# EAGLE design adapter_ADK_smt (EAGLE 6.1)
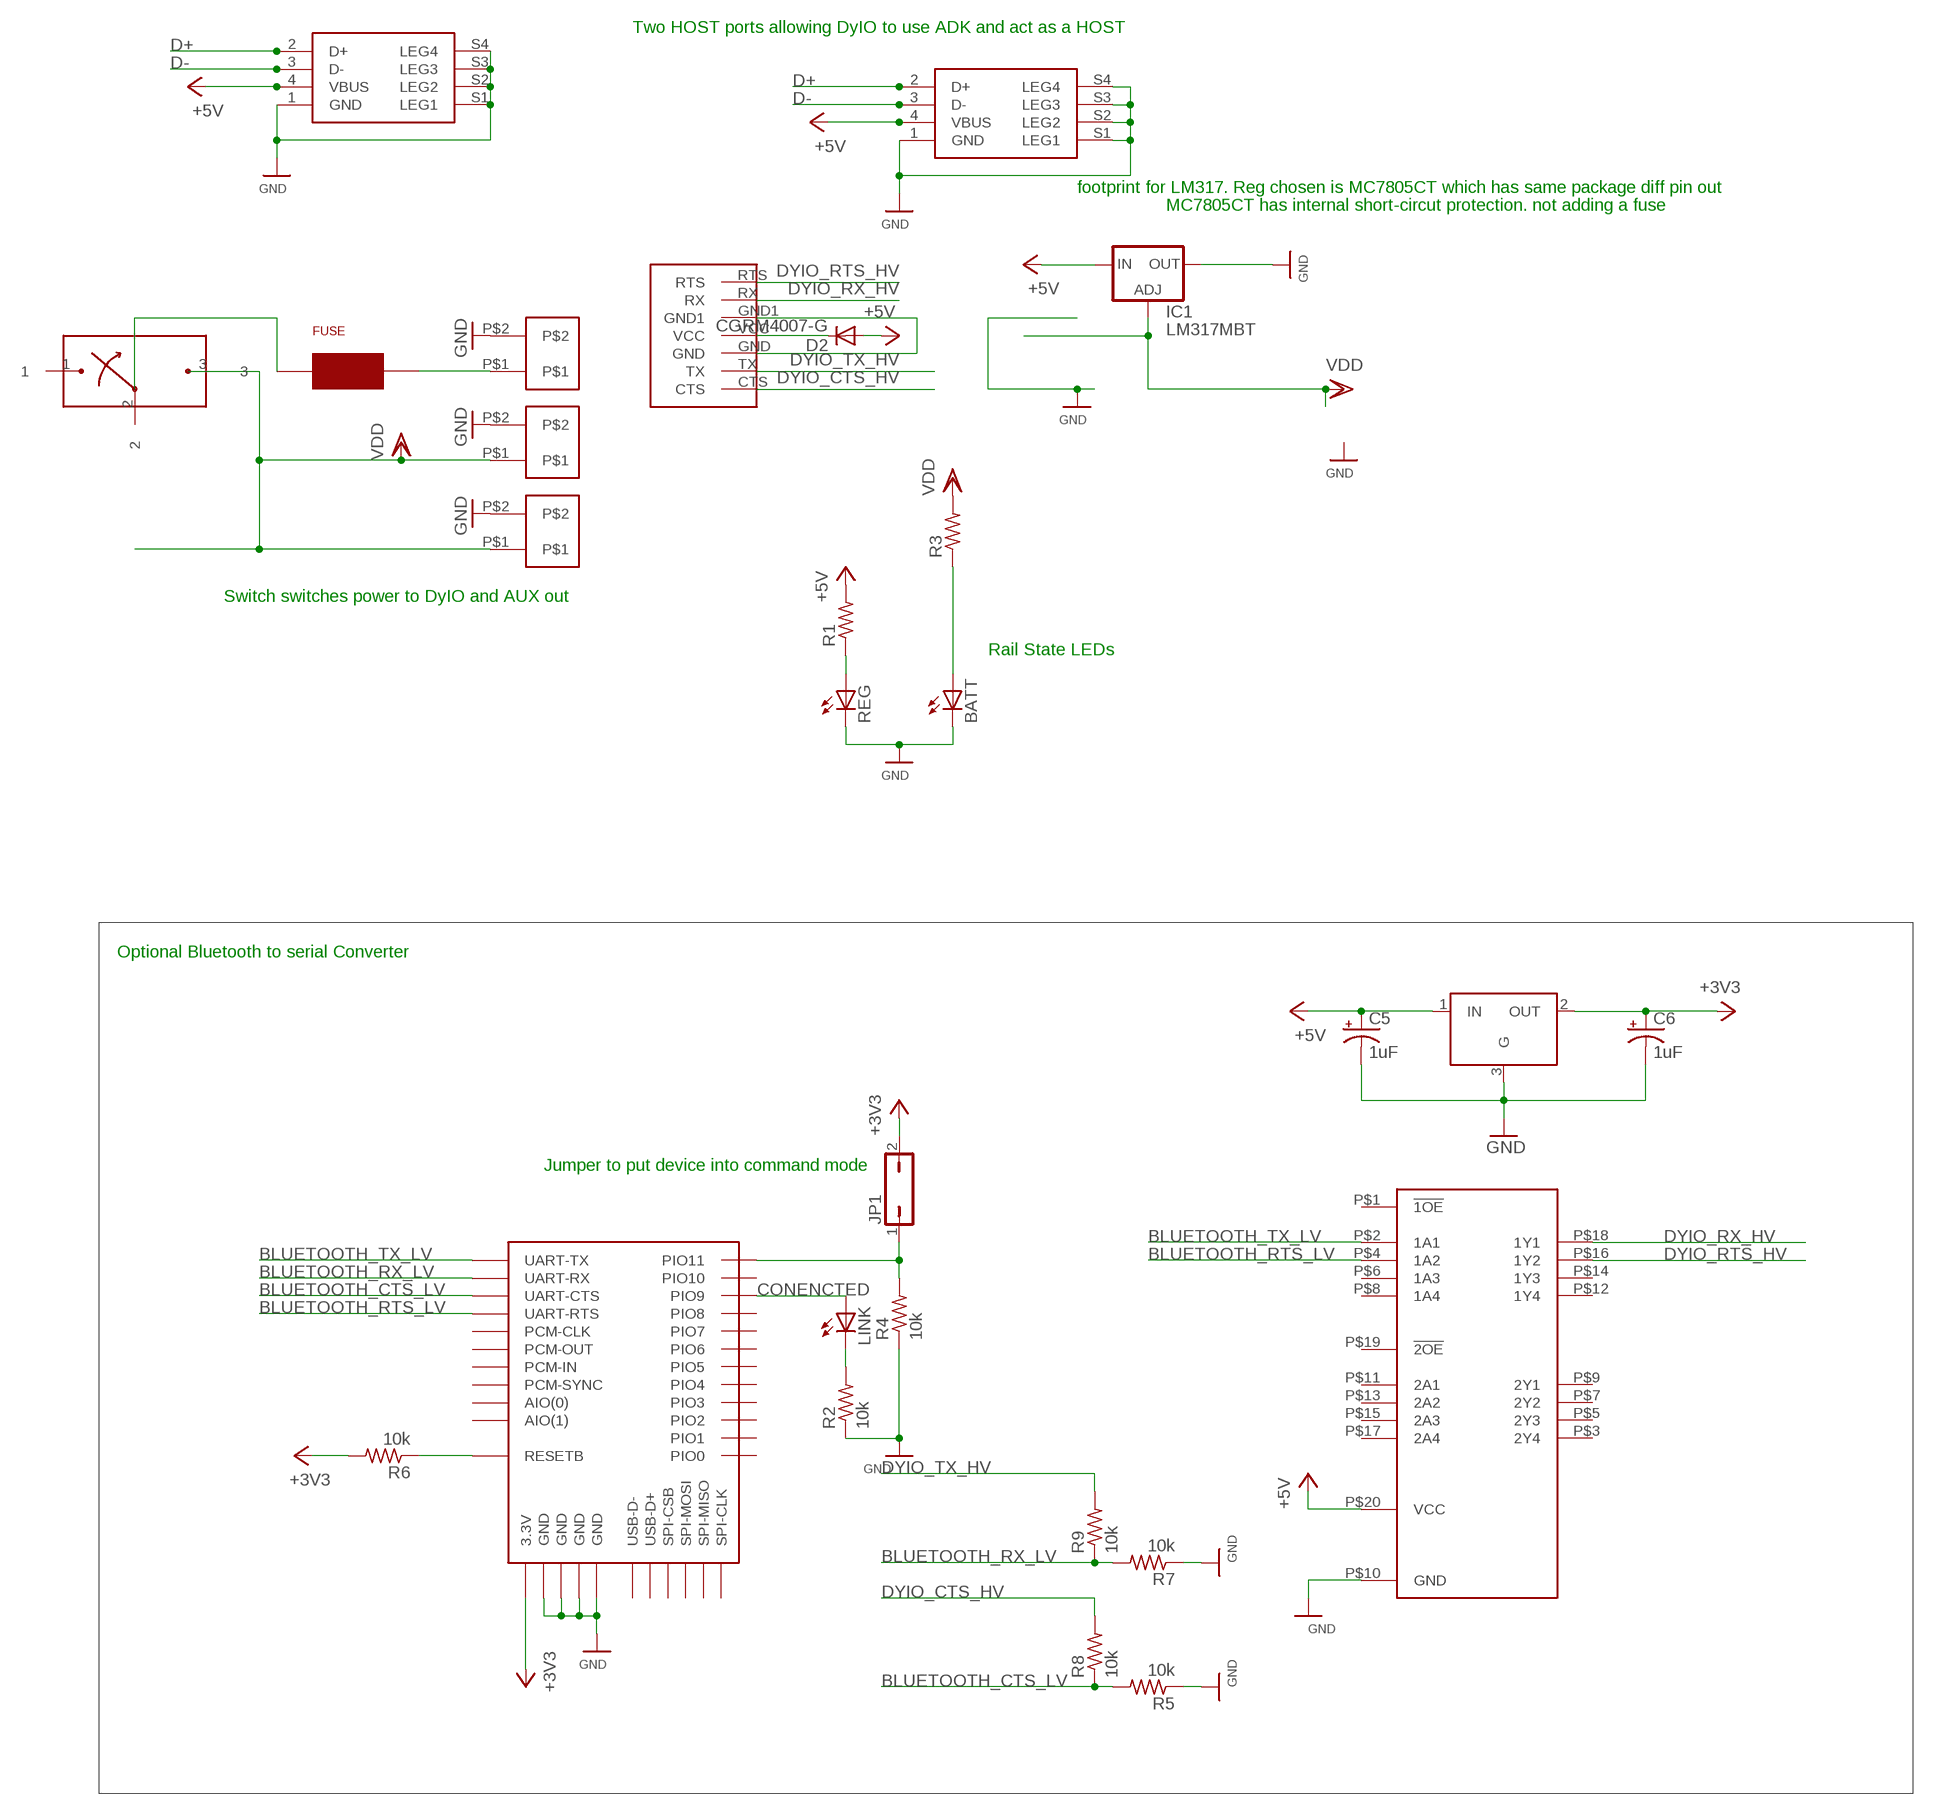
[diagram p0: schematic, sheet 1]

## Parts
BATT  LEDCHIPLED_0805  [CHIPLED_0805]
C5  1uF  CPOL-USR/2012-12R  [R/2012-12R]
C6  1uF  CPOL-USR/2012-12R  [R/2012-12R]
D2  CGRM4007-G  [SOD-123_MINI-SMA]
FUSE  0154  [0154]
IC1  LM317MBT  [TO220L1]
JP1  JP1Q  [JP1]
LINK  LEDCHIPLED_0805  [CHIPLED_0805]
R1  R-US_R0603  [R0603]
R2  10k  R-US_R0603  [R0603]
R3  R-US_R0603  [R0603]
R4  10k  R-US_R0603  [R0603]
R5  10k  R-US_R0603  [R0603]
R6  10k  R-US_R0603  [R0603]
R7  10k  R-US_R0603  [R0603]
R8  10k  R-US_R0603  [R0603]
R9  10k  R-US_R0603  [R0603]
REG  LEDCHIPLED_0805  [CHIPLED_0805]
U$1  SPDT  [L102021ML04Q]
U$3  2P  [2PTH]
U$4  2P  [2PTH]
U$6  BTM400_6B  [BTM400_6B]
U$7  SN74ACT24  [R-PDS0-G20]
U$8  USB  [USB-A1SXX]
U$9  USB  [USB-A1SXX]
U$10  WASP7PIN  [WASP7PIN]
U$11  AP7313  [SOT23-R]
U$19  2P  [2PTH]

## Nets
+3V3: C6.+ JP1.2 R6.2 U$6.3.3V U$11.2(OUT)
+5V: C5.+ D2.A IC1.3(IN) R1.2 U$7.P$20(VCC) U$8.4(VBUS) U$9.4(VBUS) U$11.1(IN)
BLUETOOTH_CTS_LV: R5.2 R8.1 U$6.UART-CTS
BLUETOOTH_RTS_LV: U$6.UART-RTS U$7.P$4(1A2)
BLUETOOTH_RX_LV: R7.2 R9.1 U$6.UART-RX
BLUETOOTH_TX_LV: U$6.UART-TX U$7.P$2(1A1)
CFG: JP1.1 R4.2 U$6.PIO(11)(PIO11)
CONENCTED: LINK.A U$6.PIO(9)(PIO9)
D+: U$8.2(D+) U$9.2(D+)
D-: U$8.3(D-) U$9.3(D-)
DYIO_CTS_HV: R8.2 U$10.CTS
DYIO_RTS_HV: U$7.P$16(1Y2) U$10.RTS
DYIO_RX_HV: U$7.P$18(1Y1) U$10.RX
DYIO_TX_HV: R9.2 U$10.TX
GND: BATT.C C5.- C6.- IC1.2(OUT) R2.1 R4.1 R5.1 R7.1 REG.C U$3.P$2 U$4.P$2 U$6.GND@1(GND) U$6.GND@2(GND) U$6.GND@3(GND) U$6.GND@4(GND) U$7.P$10(GND) U$8.1(GND) U$8.S1(LEG1) U$8.S2(LEG2) U$8.S3(LEG3) U$8.S4(LEG4) U$9.1(GND) U$9.S1(LEG1) U$9.S2(LEG2) U$9.S3(LEG3) U$9.S4(LEG4) U$10.GND U$10.GND1 U$11.3(G) U$19.P$2
N$1: FUSE.1 U$1.2
N$2: FUSE.2 U$3.P$1
N$3: R1.1 REG.A
N$4: LINK.C R2.2
N$6: BATT.A R3.1
N$7: D2.C U$10.VCC
N$8: R6.1 U$6.RESETB
VDD: IC1.1(ADJ) R3.2 U$1.3 U$4.P$1 U$19.P$1
Unconnected: U$1.1 U$6.AIO(0) U$6.AIO(1) U$6.PCM-CLK U$6.PCM-IN U$6.PCM-OUT U$6.PCM-SYNC U$6.PIO(0)(PIO0) U$6.PIO(1)(PIO1) U$6.PIO(2)(PIO2) U$6.PIO(3)(PIO3) U$6.PIO(4)(PIO4) U$6.PIO(5)(PIO5) U$6.PIO(6)(PIO6) U$6.PIO(7)(PIO7) U$6.PIO(8)(PIO8) U$6.PIO(10)(PIO10) U$6.SPI-CLK U$6.SPI-CSB U$6.SPI-MISO U$6.SPI-MOSI U$6.USB-D+ U$6.USB-D- U$7.P$1(!1OE) U$7.P$3(2Y4) U$7.P$5(2Y3) U$7.P$6(1A3) U$7.P$7(2Y2) U$7.P$8(1A4) U$7.P$9(2Y1) U$7.P$11(2A1) U$7.P$12(1Y4) U$7.P$13(2A2) U$7.P$14(1Y3) U$7.P$15(2A3) U$7.P$17(2A4) U$7.P$19(!2OE)

## Notes on the sheet
- Two HOST ports allowing DyIO to use ADK and act as a HOST
- footprint for LM317. Reg chosen is MC7805CT which has same package diff pin out
- MC7805CT has internal short-circut protection. not adding a fuse
- Switch switches power to DyIO and AUX out
- Rail State LEDs
- Optional Bluetooth to serial Converter
- Jumper to put device into command mode

## Library data of the parts
BATT LINK REG = led:LED: LED OSRAM: - CHIPLED LG R971, LG N971, LY N971, LG Q971, LY Q971, LO R971, LY R971 LH N974, LH R974 LS Q976, LO Q976, LY Q976 LO Q996 - Hyper CHIPLED LW Q18S LB Q993, LB Q99A, LB R99A - SideLED LS A670, LO A670, LY A670, LG A670, LP A670 LB A673, LV A673, LT A673, LW A673 LH A674 LY A675 LS A676, LA A676, LO A676, LY A676, LW A676 LS A679, LY A679, LG A679 - Hyper Micro SIDELED® LS Y876, LA Y876, LO Y876, LY Y876 LT Y87S - SmartLED LW L88C, LW L88S LB L89C, LB L89S, LG L890 LS L89K, LO L89K, LY L89K LS L896, LA L896, LO L896, LY L896 - TOPLED LS T670, LO T670, LY T670, LG T670, LP T670 LSG T670, LSP T670, LSY T670, LOP T670, LYG T670 LG T671, LOG T671, LSG T671 LB T673, LV T673, LT T673, LW T673 LH T674 LS T676, LA T676, LO T676, LY T676, LB T676, LH T676, LSB T676, LW T676 LB T67C, LV T67C, LT T67C, LS T67K, LO T67K, LY T67K, LW E67C LS E67B, LA E67B, LO E67B, LY E67B, LB E67C, LV E67C, LT E67C LW T67C LS T679, LY T679, LG T679 LS T770, LO T770, LY T770, LG T770, LP T770 LB T773, LV T773, LT T773, LW T773 LH T774 LS E675, LA E675, LY E675, LS T675 LS T776, LA T776, LO T776, LY T776, LB T776 LHGB T686 LT T68C, LB T68C - Hyper Mini TOPLED® LB M676 - Mini TOPLED Santana® LG M470 LS M47K, LO M47K, LY M47K Source: http://www.osram.convergy.de LUXEON: - LUMILED® LXK2-PW12-R00, LXK2-PW12-S00, LXK2-PW14-U00, LXK2-PW14-V00 LXK2-PM12-R00, LXK2-PM12-S00, LXK2-PM14-U00 LXK2-PE12-Q00, LXK2-PE12-R00, LXK2-PE12-S00, LXK2-PE14-T00, LXK2-PE14-U00 LXK2-PB12-K00, LXK2-PB12-L00, LXK2-PB12-M00, LXK2-PB14-N00, LXK2-PB14-P00, LXK2-PB14-Q00 LXK2-PR12-L00, LXK2-PR12-M00, LXK2-PR14-Q00, LXK2-PR14-R00 LXK2-PD12-Q00, LXK2-PD12-R00, LXK2-PD12-S00 LXK2-PH12-R00, LXK2-PH12-S00 LXK2-PL12-P00, LXK2-PL12-Q00, LXK2-PL12-R00 Source: www.luxeon.com KINGBRIGHT: KA-3528ASYC Source: www.kingbright.com
C5 C6 = rcl:CPOL-US: POLARIZED CAPACITOR, American symbol
D2 = diode:CGRM400*-G: Molded plasitc,JEDEC SOD-123/Mini SMA Source: Comchip CGRM4001-G.pdf
FUSE = SMT_Fuse_0154001:0154
IC1 = v-reg:LM317?*: 500 mA Adjustable Output Positive Voltage Regulator Source: http://www.onsemi.co.jp .. LM317M-D.PDF
JP1 = jumper:JP1Q: JUMPER
R1 R3 = rcl:R-US_: RESISTOR, American symbol
R2 R4-R9 = resistor:R-US_: RESISTOR, American symbol
U$1 = L102021ML04Q:SPDT
U$3 U$4 U$19 = con_2h_70555-0001:2P
U$6 = misc:BTM400_6B
U$7 = sn74act24:SN74ACT24
U$8 U$9 = usb-a1ss_vert_usb_a:USB
U$10 = wasp7pin:WASP7PIN
U$11 = ap7313:AP7313

## Board
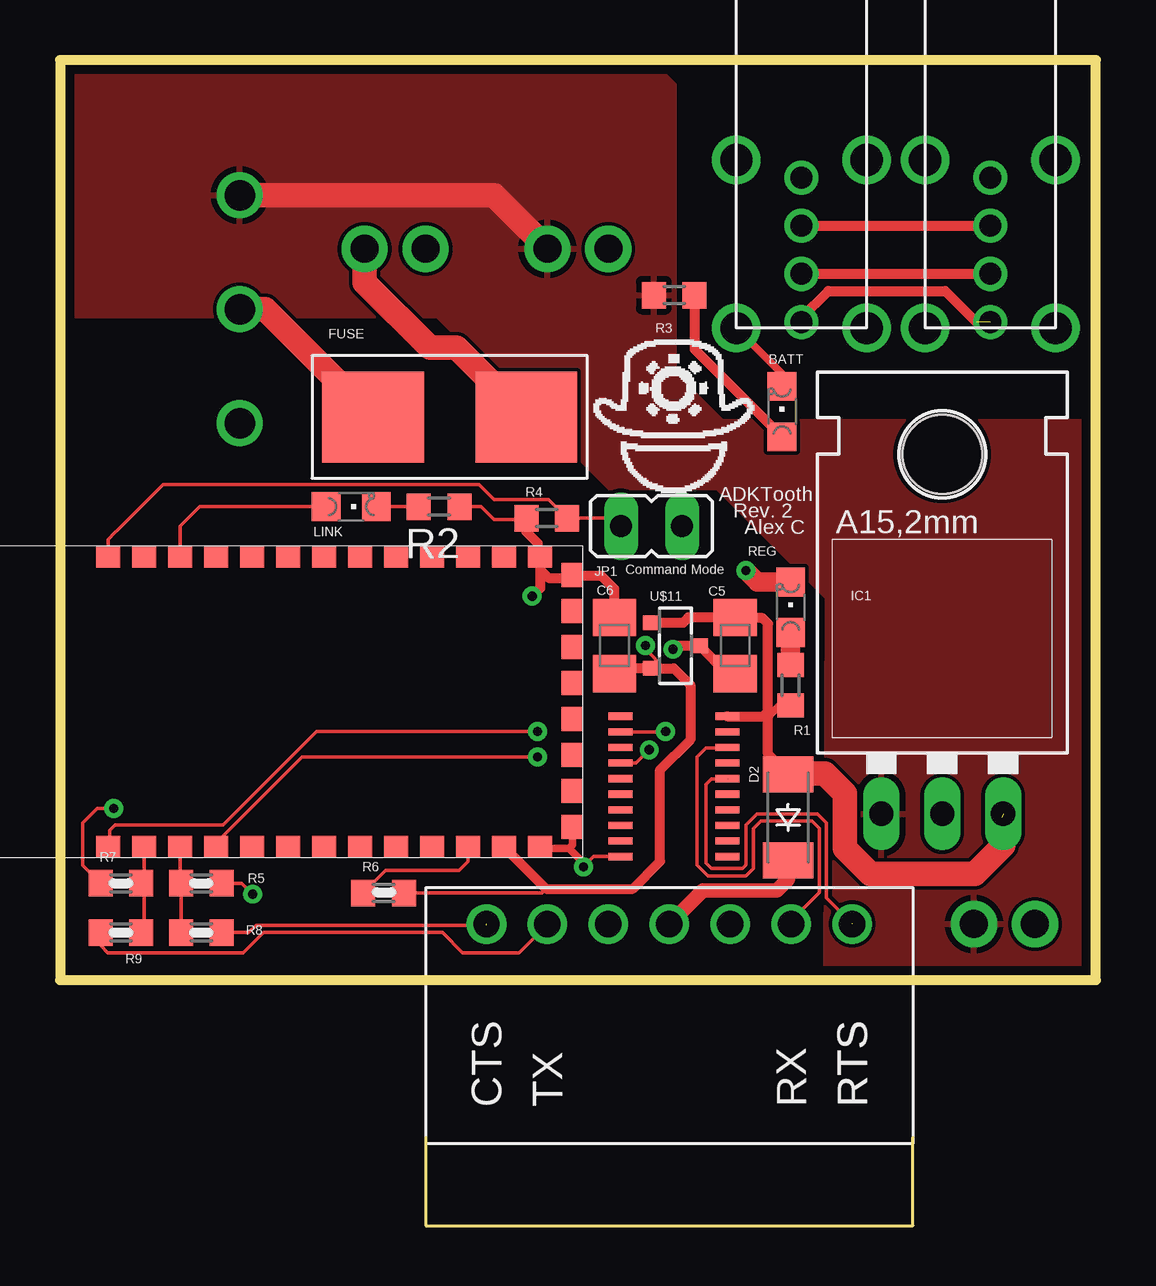
[diagram p1: board, top side]
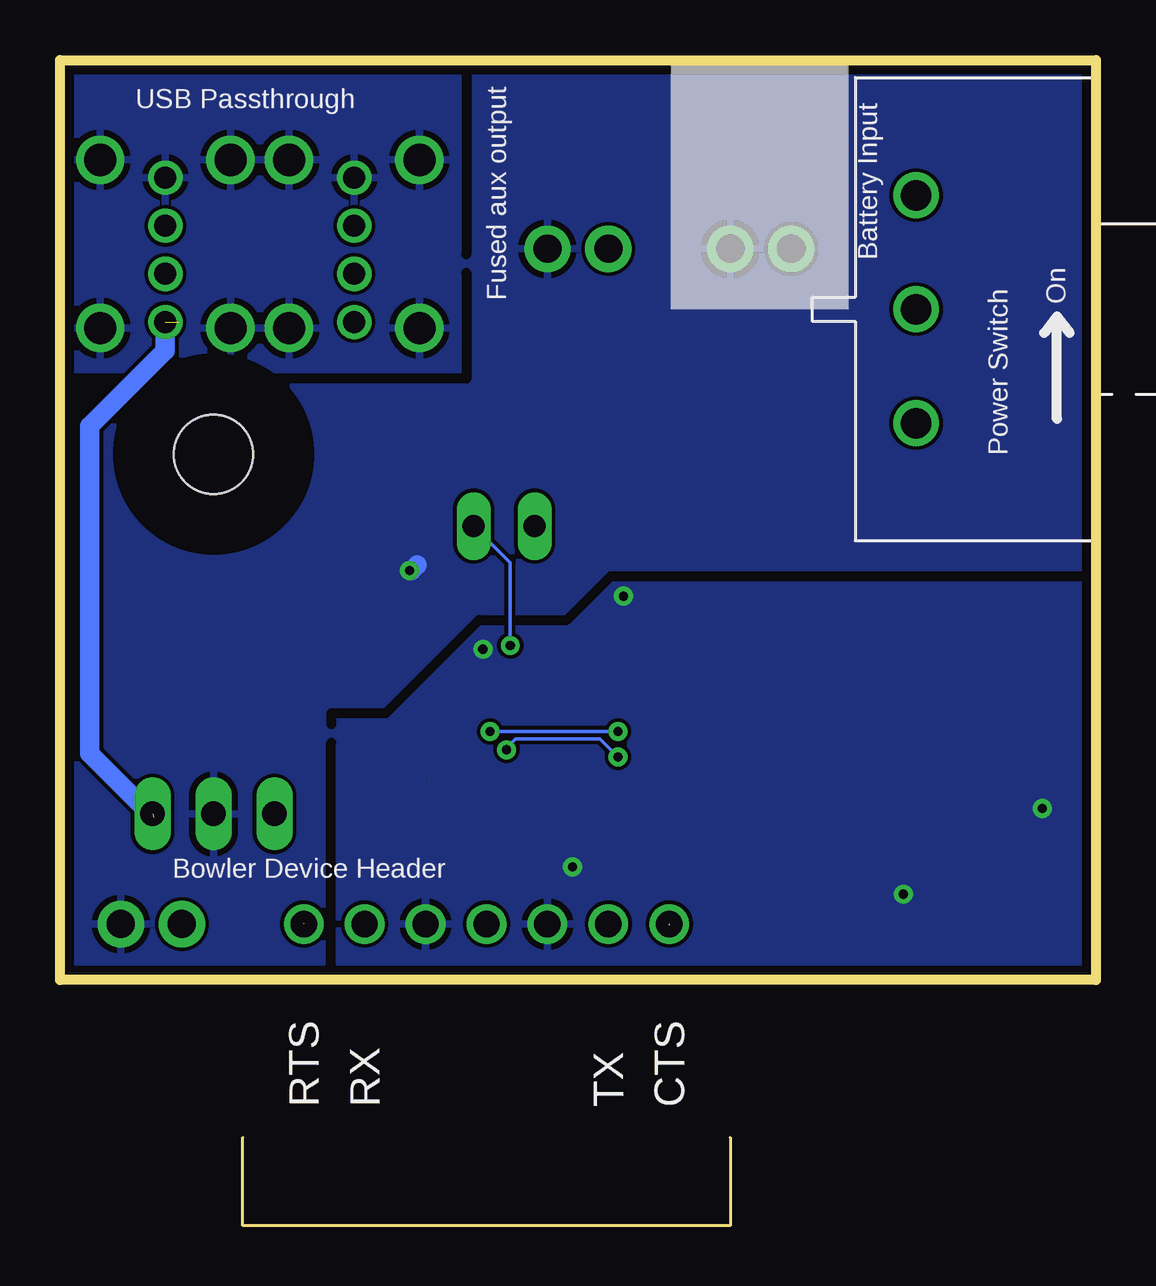
[diagram p2: board, bottom side, seen from below]

Size 43.18 x 38.35 mm. Coordinates in mm from the lower left corner, seen from the top.
Outline: 43.18,0 43.18,38.35 0,38.35 0,0 43.18,0
Copper layers (1*16): Top 0.035mm / dielectric 1.5mm / Bottom 0.035mm
Design rules: minimum track width 6mil, minimum drill 15mil, track to track 6mil, track to pad 6mil, pad to pad 6mil, via to via 6mil, smd to smd 6mil, copper to edge 15mil, drill to drill 6mil, minimum pad ring 10mil, minimum via ring 8mil, stop-mask expansion 4mil, vias tented up to drill 0mil, thermal gap 10mil
bRestrict: 10 lines

### Footprints (pad centres in the part's own frame; a part is rotated, then mirrored left to right if it is on the bottom)
CHIPLED_0805 = smd 1.2 x 1.2: A 0,-1.05; C 0,1.05
R/2012-12R = smd 1.55 x 1.8: + 1.175,0; - -1.175,0
SOD-123_MINI-SMA = smd 1.5 x 2.1: A 1.8,0; C -1.8,0
0154 = smd 4.24 x 3.81: 1 0,0; 2 6.38,0
TO220L1 = drill 1.016 long: 1 -2.54,-3.81; 2 0,-3.81; 3 2.54,-3.81 | hole 3.302: 0,11.176
JP1 = drill 0.914 long: 1 0,-1.27; 2 0,1.27
R0603 = smd 1 x 1.1: 1 -0.85,0; 2 0.85,0
L102021ML04Q = drill 1.27: 1 -7.62,-4.75; 2 -7.62,0; 3 -7.62,4.75
2PTH = drill 1.168 pad 1.93: P$1 -2.54,0; P$2 0,0
BTM400_6B = smd 0.9 x 1: 3.3V -6.05,-10.16; AIO(0) -6.05,-5.66; AIO(1) -6.05,-7.16; GND@1 -6.05,-11.66; GND@4 6.05,-11.66; PCM-CLK -6.05,0.34; PCM-IN -6.05,-2.66; PCM-OUT -6.05,-1.16; PCM-SYNC -6.05,-4.16; PIO(0) 6.05,-10.16; PIO(1) 6.05,-8.66; PIO(2) 6.05,-7.16; PIO(3) 6.05,-5.66; PIO(4) 6.05,-4.16; PIO(5) 6.05,-2.66; PIO(6) 6.05,-1.16; PIO(7) 6.05,0.34; PIO(8) 6.05,1.84; PIO(9) 6.05,3.34; PIO(10) 6.05,4.84; PIO(11) 6.05,6.34; RESETB -6.05,-8.66; UART-CTS -6.05,3.34; UART-RTS -6.05,1.84; UART-RX -6.05,4.84; UART-TX -6.05,6.34 | smd 1 x 0.9: GND@2 -5.23,-13; GND@3 5.27,-13; SPI-CLK 2.27,-13; SPI-CSB -2.23,-13; SPI-MISO 0.77,-13; SPI-MOSI -0.73,-13; USB-D+ 3.77,-13; USB-D- -3.73,-13
R-PDS0-G20 = smd 0.3 x 1: P$1 0,0; P$2 0.65,0; P$3 1.3,0; P$4 1.95,0; P$5 2.6,0; P$6 3.25,0; P$7 3.9,0; P$8 4.55,0; P$9 5.2,0; P$10 5.85,0; P$11 5.85,4.45; P$12 5.2,4.45; P$13 4.55,4.45; P$14 3.9,4.45; P$15 3.25,4.45; P$16 2.6,4.45; P$17 1.95,4.45; P$18 1.3,4.45; P$19 0.65,4.45; P$20 0,4.45
USB-A1SXX = drill 0.914: 1 -6.274,2.718; 2 -4.267,2.718; 3 -2.261,2.718; 4 -0.254,2.718 | drill 1.346: S1 -7.01,5.436; S2 0,5.436; S3 0,0; S4 -7.01,0
WASP7PIN = drill 1.1: CTS 0,0; GND 5.08,0; GND1 10.16,0; RTS 15.24,0; RX 12.7,0; TX 2.54,0; VCC 7.62,0
SOT23-R = smd 0.6 x 0.7: 1 -0.95,-1; 2 0.95,-1; 3 0,1

### Placement (x,y rotation side)
BATT  30.1,23.7 0 top
C5  28.14,13.94 90 top
C6  23.11,13.94 270 top
D2  30.35,6.78 90 top
FUSE  13.06,23.47 0 top
IC1  36.78,10.74 0 top
JP1  24.66,18.92 270 top
LINK  12.14,19.74 270 top
R1  30.45,12.29 270 top
R2  15.8,19.74 180 top
R3  25.6,28.55 180 top
R4  20.29,19.25 0 top
R5  5.89,4.04 180 top
R6  13.49,3.63 0 top
R7  2.54,4.04 0 top
R8  5.89,1.98 0 top
R9  2.54,1.98 180 top
REG  30.45,15.54 0 top
U$1  -0.13,27.97 0 bottom
U$3  15.24,30.48 0 top
U$4  22.86,30.48 0 top
U$6  8.36,11.61 90 top
U$7  23.37,11 270 top
U$8  28.19,27.18 270 top
U$9  36.07,27.18 270 top
U$10  17.78,2.34 0 top
U$11  25.65,13.94 270 top
U$19  40.64,2.34 0 top

### Tracks (layer width: path | path; a pad name or v marks a point on that pad's centre or on a via)
+3V3  (via drill 0.38)
  Top 0.152: 25.59,12.99 25.21,12.99 24.41,13.79 v24.41,13.95 | R6.2 20.09,3.63 20.26,3.81
  Top 0.406: U$6.3.3V 20.26,3.81 23.88,3.81 25.02,4.95 25.02,8.76 26.28,10.02 26.28,12.31 25.59,12.99 U$11.2 23.34,12.99 C6.+
  Bottom 0.152: v24.41,13.95 24.41,17.4 JP1.2
+5V  (2 unrouted)
  Top 0.305: R1.2 29.99,11.44 29.52,10.97
  Top 0.406: U$11.1 25.97,14.89 26.19,15.12 C5.+ 28.18,15.09 29.29,15.09 29.52,14.86 29.52,11.2 | U$7.P$20 29.31,11 29.52,11.2 | D2.A 29.52,9.42 29.52,10.97 29.52,11.2 | U$8.4 30.91,27.61 32.03,28.73 36.91,28.73 38.2,27.43
  Top 1.016: D2.A 30.38,8.61 31.88,8.61 32.72,7.77 32.72,5.49 33.78,4.42 38.12,4.42 39.32,5.61 IC1.3
  Bottom 0.813: U$9.4 38.79,26.24 41.94,23.09 41.94,9.45 39.27,6.78
BLUETOOTH_CTS_LV
  Top 0.152: U$6.UART-CTS 5.02,4.04 R5.2 R8.1
BLUETOOTH_RTS_LV  (via drill 0.38)
  Top 0.152: U$6.UART-RTS 6.81,5.85 6.81,6.02 10.08,9.3 v19.91,9.3 | v24.56,9.6 24.01,9.05 U$7.P$4
  Bottom 0.152: v19.91,9.3 20.68,10.06 24.18,10.06 24.56,9.68 v24.56,9.6
BLUETOOTH_RX_LV
  Top 0.152: U$6.UART-RX 3.52,4.04 | 3.52,4.04 R7.2 | 3.52,4.04 3.52,1.98 R9.1
BLUETOOTH_TX_LV  (via drill 0.38)
  Top 0.152: U$6.UART-TX 2.08,5.62 2.08,6.25 2.31,6.48 6.81,6.48 10.69,10.36 v19.91,10.36 | v25.25,10.36 25.23,10.35 U$7.P$2
  Bottom 0.152: v19.91,10.36 v25.25,10.36
CFG
  Top 0.152: JP1.1 23.06,19.25 R4.2 20.36,20.04 18.09,20.04 17.48,20.65 4.29,20.65 2.39,18.75 2.31,18.67 2.02,18.37 U$6.PIO(11)
CONENCTED
  Top 0.152: U$6.PIO(9) 5.02,18.94 5.82,19.74 LINK.A
D+
  Top 0.406: U$8.2 U$9.2
D-
  Top 0.406: U$8.3 U$9.3
DYIO_CTS_HV  (1 unrouted)
  Top 0.152: R8.2 7.87,1.98 8.18,2.29 17.78,2.29
DYIO_RTS_HV  (2 unrouted)
  Top 0.152: U$7.P$16 27.83,8.38 | 33.02,2.36 32.49,2.9 32.26,3.12 31.95,3.43 31.95,6.55 31.57,6.93 29.06,6.93 28.6,6.48 28.6,4.8 28.45,4.65 27.15,4.65 26.92,4.88 26.92,8.15 27.15,8.38 27.84,8.38
DYIO_RX_HV
  Top 0.152: U$7.P$18 27.8,9.68 26.92,9.68 26.54,9.3 26.54,4.8 27,4.34 28.6,4.34 28.91,4.65 28.91,6.33 29.21,6.63 31.34,6.63 31.65,6.33 31.65,3.66 30.48,2.49 U$10.RX
DYIO_TX_HV
  Top 0.152: R9.2 1.69,1.45 2,1.14 7.64,1.14 8.48,1.98 15.95,1.98 16.79,1.14 19.13,1.14 U$10.TX
GND  (via drill 0.38)
  Top 0.152: R7.1 0.94,4.79 0.94,6.55 1.55,7.16 v2.24,7.16 | R5.1 7.57,4.04 v8.03,3.58 | U$7.P$10 22.24,5.15 v21.82,4.72 | R2.1 17.55,19.74 18.09,19.2 19.39,19.2 R4.1
  Top 0.305: U$6.GND@2 21.36,5.63 21.21,5.49 | 21.21,5.49 20.09,5.49 U$6.GND@1 | v21.82,4.72 21.82,4.88 21.21,5.49 | BATT.C 30.1,25.27 U$8.S3
  Top 0.406: C5.- 27.83,12.77 U$11.3 25.7,13.95 v25.55,13.79 | C6.- 23.11,16.31 22.58,16.84 21.39,16.84 U$6.GND@3 21.24,16.76 20.37,16.76 20.02,17.12 U$6.GND@4 | U$6.GND@4 20.02,16.33 v19.69,16 | R4.1 19.45,18.68 19.91,18.21 19.91,17.76 U$6.GND@4
  Top 0.813: REG.C 29.07,16.59 v28.6,17.07
  Bottom 0.152: v2.24,7.16 2.31,7.09 2.54,7.09 | v8.03,3.58 8.18,3.73 | v21.82,4.72 21.82,4.65
  Bottom 0.406: v19.69,16 19.61,16 19.53,15.93 | v25.55,13.79 25.55,13.64
  Bottom 0.813: v28.6,17.07 28.52,17.07 28.3,17.3
  pour Bottom: -0.05,-0.08 59.16,-0.08 59.16,18.59 59.16,39.01 -7.14,39.01 -7.14,-0.08
N$1
  Top 1.016: U$1.2 8.56,27.96 FUSE.1
N$2
  Top 1.016: FUSE.2 16.54,26.36 15.42,26.36 12.7,29.08 U$3.P$1
N$3
  Top 0.813: REG.A R1.1
N$4
  Top 0.152: LINK.C R2.2
N$6
  Top 0.305: 28.69,24.05 BATT.A
  Top 0.406: R3.1 26.45,26.29 BATT.A
N$7
  Top 0.61: D2.C 30.35,4.19 29.9,3.73 26.8,3.73 U$10.VCC
N$8
  Top 0.152: R6.1 13.58,4.57 16.64,4.57 17.02,4.95 U$6.RESETB
VDD
  Top 1.016: U$1.3 18.09,32.72 U$4.P$1
  pour Top: 0.03,38.48 24.49,38.48 25.63,37.34 25.63,25.3 27.61,23.32 43.15,23.32 43.23,7.7 43.15,0.23 31.88,0.23 31.95,15.93 27.38,20.5 22.89,20.5 15.72,27.66 0.03,27.66

### Text on the board
tPlace: ADKTooth | Rev. 2 | Alex C | Command Mode
bPlace: Battery Input | Fused aux output | USB Passthrough | On | Power Switch | Bowler Device Header